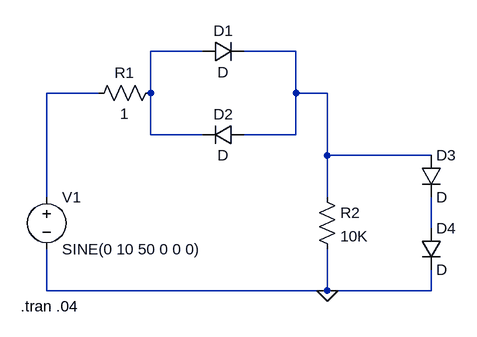
[diagram p0: schematic Draft1.asc]
Draft1.asc, the LTspice schematic file:
Version 4
SHEET 1 880 680
WIRE 304 32 224 32
WIRE 448 32 368 32
WIRE 144 96 64 96
WIRE 224 96 224 32
WIRE 448 96 448 32
WIRE 496 96 448 96
WIRE 224 160 224 96
WIRE 304 160 224 160
WIRE 448 160 448 96
WIRE 448 160 368 160
WIRE 496 192 496 96
WIRE 656 192 496 192
WIRE 64 256 64 96
WIRE 496 256 496 192
WIRE 656 304 656 256
WIRE 64 400 64 336
WIRE 496 400 496 336
WIRE 496 400 64 400
WIRE 656 400 656 368
WIRE 656 400 496 400
FLAG 496 400 0
SYMBOL voltage 64 240 R0
WINDOW 123 0 0 Left 0
WINDOW 39 0 0 Left 0
SYMATTR InstName V1
SYMATTR Value SINE(0 10 50 0 0 0)
SYMBOL res 240 80 R90
WINDOW 0 0 56 VBottom 2
WINDOW 3 32 56 VTop 2
SYMATTR InstName R1
SYMATTR Value 1
SYMBOL diode 304 48 R270
WINDOW 0 32 32 VTop 2
WINDOW 3 0 32 VBottom 2
SYMATTR InstName D1
SYMBOL diode 368 144 R90
WINDOW 0 0 32 VBottom 2
WINDOW 3 32 32 VTop 2
SYMATTR InstName D2
SYMBOL res 480 240 R0
SYMATTR InstName R2
SYMATTR Value 10K
SYMBOL diode 640 192 R0
SYMATTR InstName D3
SYMBOL diode 640 304 R0
SYMATTR InstName D4
TEXT 24 424 Left 2 !.tran .04

The netlist it stands for:
* Draft1.asc
V1 N003 0 SINE(0 10 50 0 0 0)
R1 N001 N003 1
D1 N001 N002 D
D2 N002 N001 D
R2 N002 0 10K
D3 N002 N004 D
D4 N004 0 D
.model D D
.lib standard.dio
.tran .04
.backanno
.end